# Altium schematic sheet Connectors.SchDoc
size OrCAD A; SheetNumber: 6; SheetTotal: 8
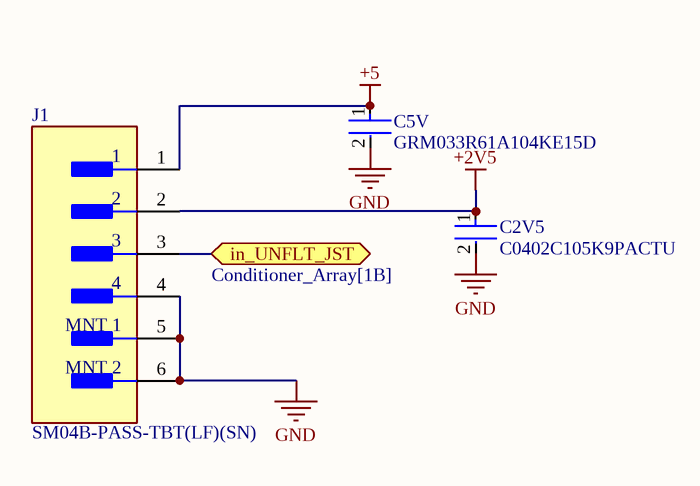
[diagram p0: Connectors.SchDoc]

## Parts
C2V5  C0402C105K9PACTU  [FP-C0402C105K9PACTU-MFG]
C5V  GRM033R61A104KE15D  [FP-GRM033-0_03-IPC_C]
J1  SM04B-PASS-TBT(LF)(SN)  [FP-SM04B-PASS-TBT_LF_SN-MFG]

## Ports
in_UNFLT_JST (bidir, see Conditioner_Array[1B])

## Nets
+2V5: C2V5.1 J1.2
+5: C5V.1 J1.1
GND: C2V5.2 C5V.2 J1.4 J1.5(MNT_1) J1.6(MNT_2)
in_UNFLT_JST: J1.3 ; port in_UNFLT_JST

## Library data of the parts
C2V5 = CMP-2008-02075-2: CAP CER 1UF 6.3V X5R 0402; Tolerance: 10%; Dielectric Material: Ceramic; Series: C; Lead Free: Lead Free; Min Operating Temperature: -55°C; Capacitance: 1uF; Voltage Rating (DC): 6.3V; Number of Pins: 2; REACH SVHC: No SVHC; Mount: Surface Mount; Lead Pitch: 0.3mm; Case Code (Imperial): 0402; RoHS Compliant: Yes; Radiation Hardening: No; Construction: Flat; Depth: 0.5mm; Case/Package: 0402; Termination: SMD/SMT; Height: 0.5mm; Thickness: 0.022inch; Voltage: 6.3V; Dielectric: X5R; Width: 0.02inch; Voltage Rating: 6.3V; Max Operating Temperature: 85°C; Packaging: Tape and Reel; Package Quantity: 1; Length: 1mm
C5V = CMP-2010-01264-2: Chip Multilayer Ceramic Capacitors for General Purpose, 0201, 0.10uF, X5R, 15%, 10%, 10V; Capacitance: 100nF; Mount: Surface Mount; Dielectric: X5R; Width: 0.012inch; Tolerance: 10%; Radiation Hardening: No; Voltage Rating: 10V; REACH SVHC: No SVHC; Height: 0.3mm; Max Operating Temperature: 85°C; Voltage Rating (DC): 10V; Thickness: 0.013inch; Termination: SMD/SMT; Lead Free: Lead Free; Package Quantity: 1; Case/Package: 0201; Min Operating Temperature: -55°C; Weight: 6E-06oz; Length: 0.6mm; Case Code (Imperial): 0201; Depth: 0.3mm; Voltage: 10V; Packaging: Tape and Reel; Case Code (Metric): 0603
J1 = CMP-2000-07078-2: CONN HEADER SMD R/A 4POS 2MM; Manufacturer: JST; Voltage Rating: 250V; Current Rating: 3A; Conn Gender: Male; Conn Orientation: Right Angle; Number Of Contacts: 4; Height: 5.7mm; Contact Material: Tin; Device Class L2: Headers and Wire Housings; Number Of Rows: 1; Device Class L1: Connectors; RoHS: TRUE; Lead Free: Yes; Automotive: No; Digikey Description: CONN HEADER SMD R/A 4POS 2MM; Manufacturer Part Number: SM04B-PASS-TBT(LF)(SN); Temperature: -25°C to +85°C; Package: SM04B-PASS-TBT(LF)(SN); Temperature Range Low: -25°C; ComponentLink2Description: Datasheet; Temperature Range High: +85°C; Pitch: 2mm; ComponentLink2URL: http://www.jst-mfg.com/product/pdf/eng/ePA-F.pdf; Octopart: https://octopart.com/sm04b-pass-tbt%28lf%29%28sn%29-jst-3990422; Category: Conn; Device Class L3: unset